# EAGLE design MicroMod-LoRa-1W-Function-Board (EAGLE 9.6.2)
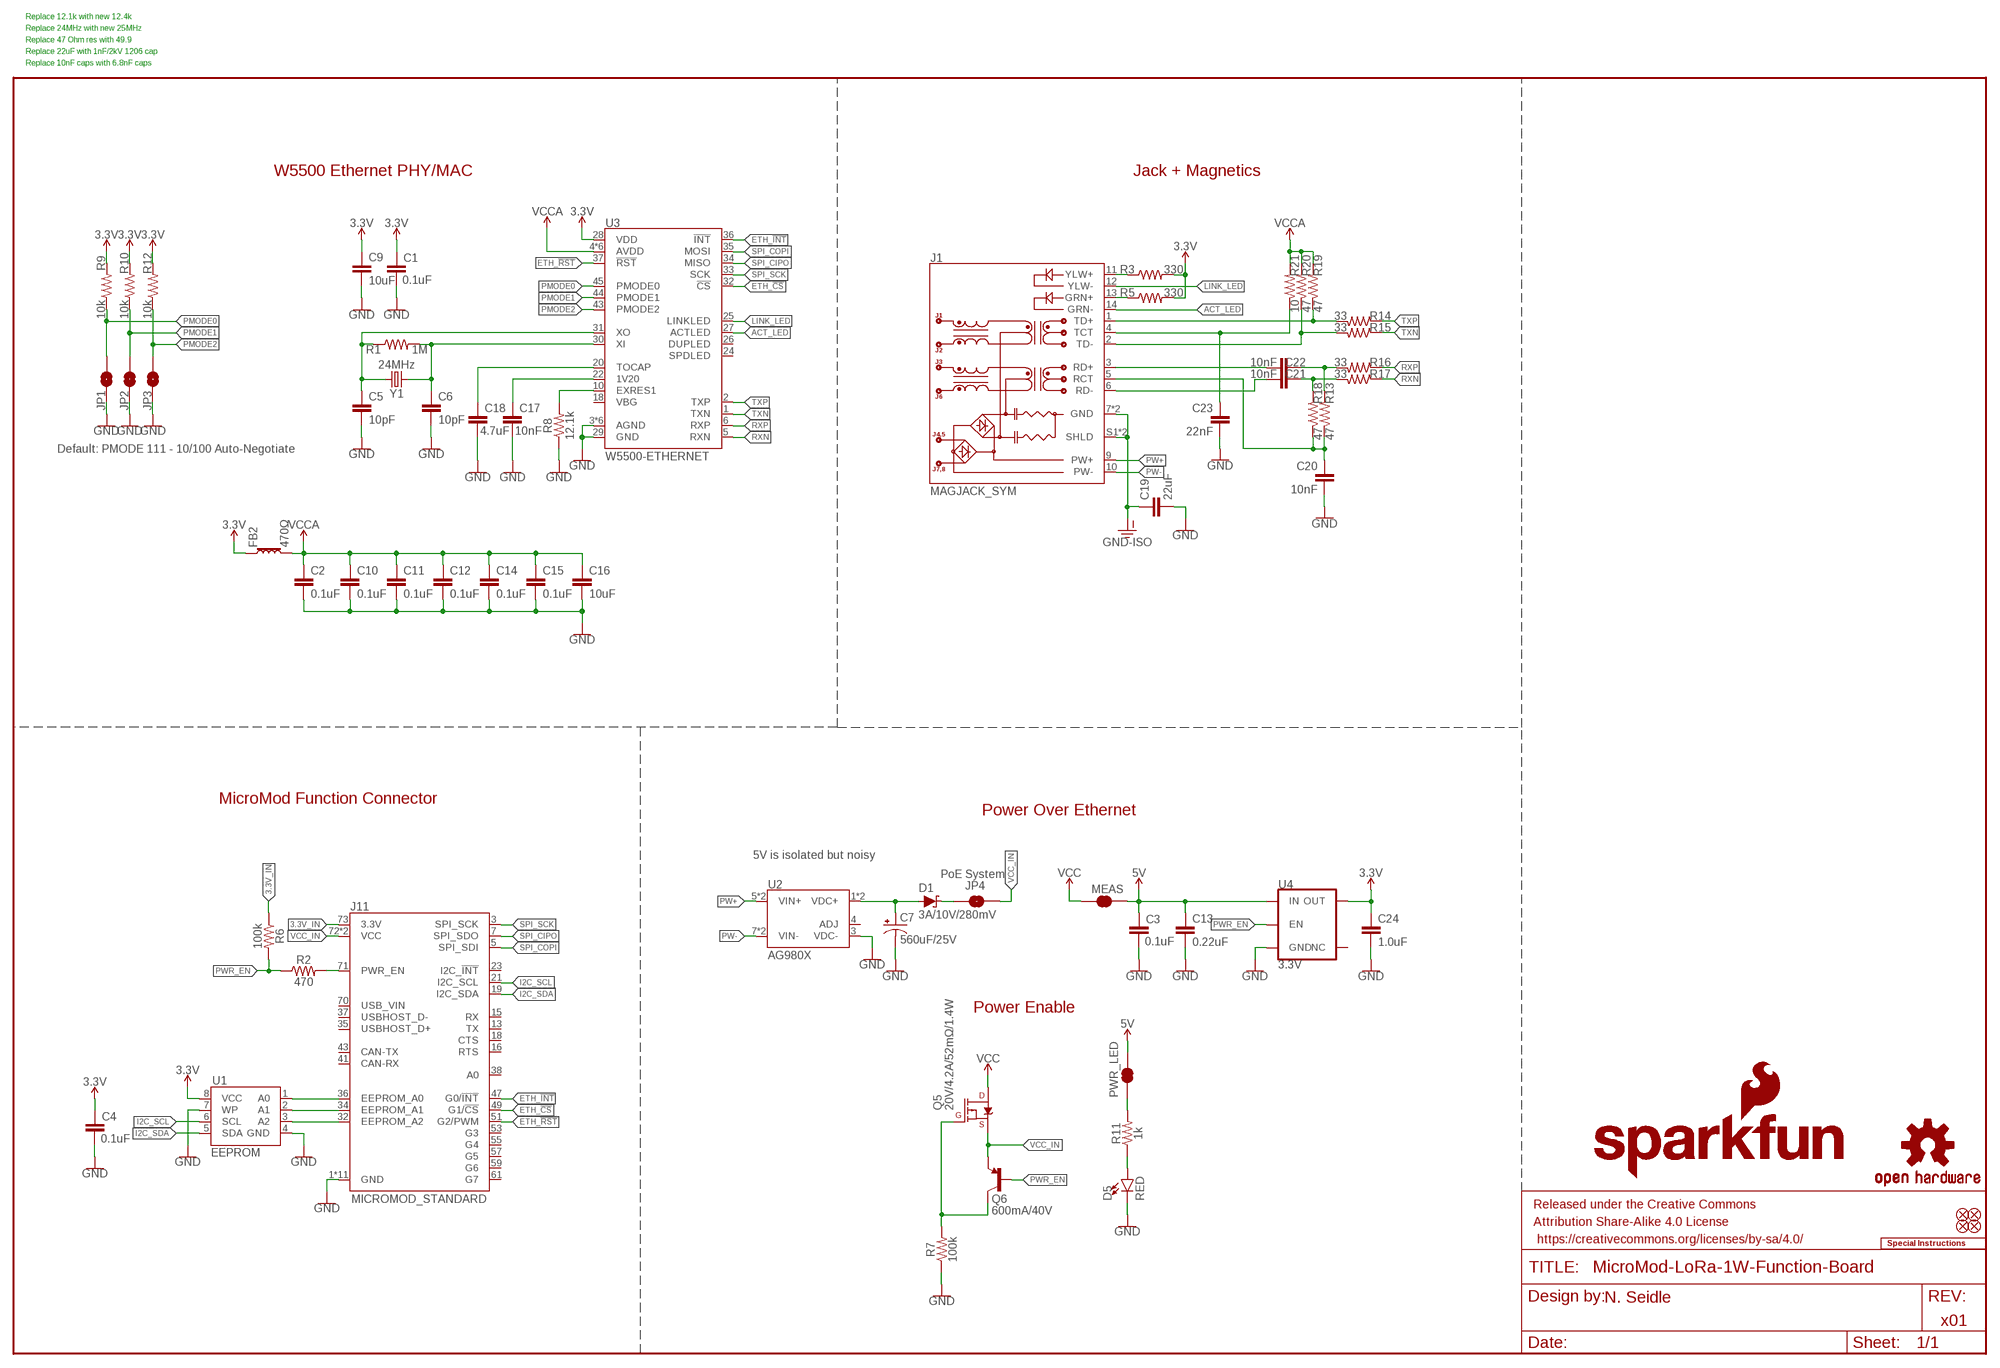
[diagram p0: schematic, sheet 1]

## Parts
C1  0.1uF  0.1UF-0603-25V-(+80/-20%)  [0603]
C2  0.1uF  0.1UF-0603-25V-5%  [0603]
C3  0.1uF  0.1UF-0603-25V-(+80/-20%)  [0603]
C4  0.1uF  0.1UF-0603-25V-(+80/-20%)  [0603]
C5  10pF  10PF-0603-50V-5%  [0603]
C6  10pF  10PF-0603-50V-5%  [0603]
C7  560uF/25V  560UF-PANASONIC_G-25V-20%  [PANASONIC_G]
C9  10uF  10UF-0603-6.3V-20%  [0603]
C10  0.1uF  0.1UF-0603-25V-5%  [0603]
C11  0.1uF  0.1UF-0603-25V-5%  [0603]
C12  0.1uF  0.1UF-0603-25V-5%  [0603]
C13  0.22uF  0.22UF-0603-25V-10%  [0603]
C14  0.1uF  0.1UF-0603-25V-5%  [0603]
C15  0.1uF  0.1UF-0603-25V-5%  [0603]
C16  10uF  10UF-0603-6.3V-20%  [0603]
C17  10nF  10NF-0603-50V-10%  [0603]
C18  4.7uF  4.7UF-0603-6.3V-(10%)  [0603]
C19  22uF  22UF-1206-50V-10%  [1206]
C20  10nF  10NF-0603-50V-10%  [0603]
C21  10nF  10NF-0603-50V-10%  [0603]
C22  10nF  10NF-0603-50V-10%  [0603]
C23  22nF  22NF/22,000PF-0603-50V-10%  [0603]
C24  1.0uF  1.0UF-0603-16V-10%-X7R  [0603]
D1  3A/10V/280mV  DIODE-SCHOTTKY-BAT60A  [SOD-323]
D5  RED  LED-RED0603  [LED-0603]
FB2  470Ω  FERRITE_BEAD-0603-470Ω-100MHZ-1A-200MILIΩ  [0603]
FD1  FIDUCIALUFIDUCIAL  [FIDUCIAL-MICRO]
FD2  FIDUCIALUFIDUCIAL  [FIDUCIAL-MICRO]
FD3  FIDUCIALUFIDUCIAL  [FIDUCIAL-MICRO]
FD4  FIDUCIALUFIDUCIAL  [FIDUCIAL-MICRO]
FRAME1  FRAME-LEDGER  [CREATIVE_COMMONS]
J1  MAGJACK_SYM  [MAGJACK-STR_LED]
J11  MICROMOD_STANDARD  [M.2-CARD-E-22_FUNCTION_STANDARD]
JP1  JUMPER-SMT_2_NO_SILK  [SMT-JUMPER_2_NO_SILK]
JP2  JUMPER-SMT_2_NO_SILK  [SMT-JUMPER_2_NO_SILK]
JP3  JUMPER-SMT_2_NO_SILK  [SMT-JUMPER_2_NO_SILK]
JP4  PoE System  JUMPER-SMT_2_NO_SILK  [SMT-JUMPER_2_NO_SILK]
LOGO1  SFE_LOGO_NAME_FLAME.1_INCH  [SFE_LOGO_NAME_FLAME_.1]
LOGO2  SPECIAL_INSTRUCTIONS-ORDERING  [ORDERING_INSTRUCTIONS]
LOGO3  OSHW-LOGOMINI  [OSHW-LOGO-MINI]
MEAS  JUMPER-COMBO_2_NC_TRACE  [COMBO-JUMPER_2_NC_TRACE]
PWR_LED  JUMPER-SMT_2_NC_TRACE_SILK  [SMT-JUMPER_2_NC_TRACE_SILK]
Q5  20V/4.2A/52mΩ/1.4W  MOSFET_PCH-DMG2305UX-7  [SOT23-3]
Q6  600mA/40V  TRANS_PNP-MMBT4403  [SOT23-3]
R1  1M  1MOHM-0603-1/4W-5%  [0603]
R2  470  470OHM-0603-1/10W-1%  [0603]
R3  330  330OHM-0603-1/10W-1%  [0603]
R5  330  330OHM-0603-1/10W-1%  [0603]
R6  100k  100KOHM-0603-1/10W-1%  [0603]
R7  100k  100KOHM-0603-1/10W-1%  [0603]
R8  12.1k  12.1KOHM-0603-1/10W-1%  [0603]
R9  10k  10KOHM-0603-1/10W-1%  [0603]
R10  10k  10KOHM-0603-1/10W-1%  [0603]
R11  1k  1KOHM-0603-1/10W-1%  [0603]
R12  10k  10KOHM-0603-1/10W-1%  [0603]
R13  47  47OHM-0603-1/10W-1%  [0603]
R14  33  33OHM-0603-1/10W-1%  [0603]
R15  33  33OHM-0603-1/10W-1%  [0603]
R16  33  33OHM-0603-1/10W-1%  [0603]
R17  33  33OHM-0603-1/10W-1%  [0603]
R18  47  47OHM-0603-1/10W-1%  [0603]
R19  47  47OHM-0603-1/10W-1%  [0603]
R20  47  47OHM-0603-1/10W-1%  [0603]
R21  10  10OHM-0603-1/10W-1%  [0603]
U1  EEPROM  EEPROM-I2C512K  [SO08]
U2  AG980X  [AG980X]
U3  W5500-ETHERNET  [LQFP-48]
U4  3.3V  V_REG_AP2112K-3.3V  [SOT23-5]
Y1  24MHz  CRYSTAL-24MHZ-SMD-2.0X1.6MM  [CRYSTAL-SMD-2.0X1.6MM]

## Nets
3.3V: C1.1 C4.1 C9.1 C24.1 FB2.1 R3.2 R5.2 R9.2 R10.2 R12.2 U1.8(VCC) U3.28(VDD) U4.5(OUT)
3.3V_IN: J11.73(3.3V) R6.1
5V: C3.1 C13.1 MEAS.2 MEAS.4 PWR_LED.2 U4.1(IN)
5V_RAW: C7.+ D1.A U2.1(VDC+) U2.2(VDC+)
A0: J11.36(EEPROM_A0) U1.1(A0)
A1: J11.34(EEPROM_A1) U1.2(A1)
A2: J11.32(EEPROM_A2) U1.3(A2)
ACT_LED: J1.14(GRN-) U3.27(ACTLED)
ETH_!CS!: J11.49(G1/!CS!) U3.32(!CS!)
ETH_!INT!: J11.47(G0/!INT!) U3.36(!INT!)
ETH_!RST!: J11.51(G2/PWM) U3.37(!RST!)
GND: C1.2 C2.2 C3.2 C4.2 C5.2 C6.2 C7.- C9.2 C10.2 C11.2 C12.2 C13.2 C14.2 C15.2 C16.2 C17.2 C18.2 C19.2 C20.2 C23.2 C24.2 D5.C J11.1(GND) J11.33(GND) J11.39(GND) J11.45(GND) J11.75(GND) J11.GND1(GND) J11.GND2(GND) J11.GND3(GND) J11.GND4(GND) J11.GND5(GND) J11.GND6(GND) JP1.1 JP2.1 JP3.1 R7.1 R8.1 U1.4(GND) U1.7(WP) U2.3(VDC-) U3.3(AGND) U3.9(AGND) U3.14(AGND) U3.16(AGND) U3.19(AGND) U3.29(GND) U3.48(AGND) U4.2(GND)
GND-ISO: C19.1 J1.7(GND) J1.8(GND) J1.S1(SHLD) J1.S2(SHLD)
I2C_SCL: J11.21(I2C_SCL) U1.6(SCL)
I2C_SDA: J11.19(I2C_SDA) U1.5(SDA)
LINK_LED: J1.12(YLW-) U3.25(LINKLED)
N$1: C5.1 R1.1 U3.31(XO) Y1.1
N$2: C6.1 R1.2 U3.30(XI) Y1.3
N$4: J11.71(PWR_EN) R2.2
N$5: D5.A R11.1
N$6: PWR_LED.1 R11.2
N$7: D1.C JP4.1
N$8: J1.13(GRN+) R5.1
N$10: J1.11(YLW+) R3.1
N$11: Q5.1(G) Q6.3(C) R7.2
N$13: R8.2 U3.10(EXRES1)
N$15: C17.1 U3.22(1V20)
N$16: C18.1 U3.20(TOCAP)
PMODE0: JP1.2 R9.1 U3.45(PMODE0)
PMODE1: JP2.2 R10.1 U3.44(PMODE1)
PMODE2: JP3.2 R12.1 U3.43(PMODE2)
PW+: J1.9(PW+) U2.5(VIN+) U2.6(VIN+)
PW-: J1.10(PW-) U2.7(VIN-) U2.8(VIN-)
PWR_EN: Q6.1(B) R2.1 R6.2 U4.3(EN)
RCT: C20.1 J1.5(RCT) R13.1 R18.1
RD+: C22.2 J1.3(RD+)
RD-: C21.2 J1.6(RD-)
RXN: R17.1 U3.5(RXN)
RXN1: C21.1 R17.2 R18.2
RXP: R16.1 U3.6(RXP)
RXP1: C22.1 R13.2 R16.2
SPI_CIPO: J11.7(SPI_SDO) U3.34(MISO)
SPI_COPI: J11.5(SPI_SDI) U3.35(MOSI)
SPI_SCK: J11.3(SPI_SCK) U3.33(SCK)
TCT: C23.1 J1.4(TCT) R21.1
TD+: J1.1(TD+) R14.2 R19.1
TD-: J1.2(TD-) R15.2 R20.1
TXN: R15.1 U3.1(TXN)
TXP: R14.1 U3.2(TXP)
VCC: MEAS.1 MEAS.3 Q5.3(D)
VCC_IN: J11.72(VCC) J11.74(VCC) JP4.2 Q5.2(S) Q6.2(E)
VCCA: C2.1 C10.1 C11.1 C12.1 C14.1 C15.1 C16.1 FB2.2 R19.2 R20.2 R21.2 U3.4(AVDD) U3.8(AVDD) U3.11(AVDD) U3.15(AVDD) U3.17(AVDD) U3.21(AVDD)
Unconnected: J11.13(TX) J11.15(RX) J11.16(RTS) J11.18(CTS) J11.23(I2C_!INT!) J11.35(USBHOST_D+) J11.37(USBHOST_D-) J11.38(A0) J11.41(CAN-RX) J11.43(CAN-TX) J11.53(G3) J11.55(G4) J11.57(G5) J11.59(G6) J11.61(G7) J11.70(USB_VIN) U2.4(ADJ) U3.18(VBG) U3.24(SPDLED) U3.26(DUPLED) U4.4(NC)

## Notes on the sheet
- Replace 12.1k with new 12.4k
- Replace 24MHz with new 25MHz
- Replace 47 Ohm res with 49.9
- Replace 22uF with 1nF/2kV 1206 cap
- Replace 10nF caps with 6.8nF caps
- W5500 Ethernet PHY/MAC | Jack + Magnetics
- Default: PMODE 111 - 10/100 Auto-Negotiate
- MicroMod Function Connector
- Power Over Ethernet
- 5V is isolated but noisy
- Power Enable
- N. Seidle
- x01

## Library data of the parts
C1 C3 C4 = SparkFun-Capacitors:0.1UF: 0.1µF ceramic capacitors A capacitor is a passive two-terminal electrical component used to store electrical energy temporarily in an electric field.; PROD_ID: CAP-00810
C2 C10-C12 C14 C15 = SparkFun-Capacitors:0.1UF: 0.1µF ceramic capacitors A capacitor is a passive two-terminal electrical component used to store electrical energy temporarily in an electric field.; PROD_ID: CAP-08604
C5 C6 = SparkFun-Capacitors:10PF: 10pF ceramic capacitors A capacitor is a passive two-terminal electrical component used to store electrical energy temporarily in an electric field.; PROD_ID: CAP-11812
C7 = SparkFun-Capacitors:560UF: 560µF polarized capacitors A capacitor is a passive two-terminal electrical component used to store electrical energy temporarily in an electric field.; PROD_ID: CAP-09983; VALUE: 560uF
C9 C16 = SparkFun-Capacitors:10UF: 10.0µF ceramic capacitors A capacitor is a passive two-terminal electrical component used to store electrical energy temporarily in an electric field.; PROD_ID: CAP-11015
C13 = SparkFun-Capacitors:0.22UF: 0.22µF ceramic capacitors A capacitor is a passive two-terminal electrical component used to store electrical energy temporarily in an electric field.; PROD_ID: CAP-07822
C17 C20-C22 = SparkFun-Capacitors:10NF: 0.01uF/10nF/10,000pF ceramic capacitors A capacitor is a passive two-terminal electrical component used to store electrical energy temporarily in an electric field. CAP-09321; PROD_ID: CAP-00867
C18 = SparkFun-Capacitors:4.7UF: 4.7µF ceramic capacitors A capacitor is a passive two-terminal electrical component used to store electrical energy temporarily in an electric field.; PROD_ID: CAP-08280
C19 = SparkFun-Capacitors:22UF: 22µF ceramic capacitors A capacitor is a passive two-terminal electrical component used to store electrical energy temporarily in an electric field.; PROD_ID: CAP-15263
C23 = SparkFun-Capacitors:22NF/22,000PF: 0.022uF/22nF/22,000pF ceramic capacitors A capacitor is a passive two-terminal electrical component used to store electrical energy temporarily in an electric field.; PROD_ID: CAP-07885
C24 = SparkFun-Capacitors:1.0UF: 1µF ceramic capacitors A capacitor is a passive two-terminal electrical component used to store electrical energy temporarily in an electric field.; PROD_ID: CAP-13930
D1 = SparkFun-DiscreteSemi:DIODE-SCHOTTKY: Schottky diode A Schottky diode is a semiconductor diode which has a low forward voltage drop and a very fast switching action.; PROD_ID: DIO-14072
D5 = SparkFun-LED:LED-RED: Red SMD LED Used in manufacturing of most products at SparkFun Packages: 0603 - SMD 0603 package [Product Link] <http://docs.avagotech.com/docs/AV02-0551EN> 0603 SMART - SMD 0603 SMART package ( more efficient and expensive)[Product Link] <http://www.osram-os.com/Graphics/XPic2/00077099_0.pdf> 1206 - SMD1206 package [Product Link] <https://www.sparkfun.com/datasheets/DevTools/LilyPad/Q150OVS4.pdff> SparkFun Products: Pro Mini 328 -5V <https://www.sparkfun.com/products/821> RedBoard <https://www.sparkfun.com/products/12757> IOIO-OTG <https://www.sparkfun.com/products/13613>; PROD_ID: DIO-00819
FB2 = SparkFun-Coils:FERRITE_BEAD: Ferrite Bead (blocks, cores, rings, chokes, etc.) Inductor with layers of ferrite used to suppress high frequencies. Often used to isolate high frequency noise. SparkFun Products: IOIO-OTG - V2.2 <https://www.sparkfun.com/products/13613> SparkFun SAMD21 Mini Breakout <https://www.sparkfun.com/products/13664> SparkFun 6 Degrees of Freedom Breakout - LSM6DS3 <https://www.sparkfun.com/products/13339> SparkFun SAMD21 Dev Breakout <https://www.sparkfun.com/products/13672>; PROD_ID: NDUC-12579
FD1-FD4 = SparkFun-Aesthetics:FIDUCIAL: Fiducial Alignment Points Point-of-reference for pick-and-place machines and other optical instruments.
FRAME1 = SparkFun-Aesthetics:FRAME-LEDGER: Schematic Frame - Ledger Standard 11x14 US Ledger frame
J1 = Ethernet:MAGJACK_SYM
J11 = SparkFun-MicroMod-Function:MICROMOD: MicroMod Connector Description: A card edge connector and mating PCB connector to allow various MicroMod Processor Boards to be coupled with various carrier boards of different capabilities. Based on the M.2 standard.
JP1-JP4 = SparkFun-Jumpers:JUMPER-SMT_2_NO: Normally open jumper This jumper has two pads in close proximity to each other. Apply solder to close the connection. Round pads are easier to solder for beginners, but are a lot larger. SparkFun Product that uses the round pads: SparkFun EL Sequencer <https://www.sparkfun.com/products/12781>
LOGO1 = SparkFun-Aesthetics:SFE_LOGO_NAME_FLAME: SparkFun Font Logo w/ Flame This is the SparkFun full logo. The logo on the schematic will always be the same size; the package variant is the height of the flame part of the logo. Default layer for the logo on the board is tSilk.
LOGO2 = SparkFun-Aesthetics:SPECIAL_INSTRUCTIONS: Special Ordering/Production Instructions Alert Symbol for special PCB ordering instructions or unique production process warnings. Ordering Instructions Production Instructions Types of information that should be added to box: Copper weight Soldermask color Silk color PCB thickness Number of layers PCB Standard: 1.6mm FR4 1 oz copper immersion silver plating red soldermask white silkscreen Types of information that should be added to box: Special wash requirements Depaneling instructions Humidification Glue curing Default text settings: 0.07 inch 9% ratio 50% line distance
LOGO3 = SparkFun-Aesthetics:OSHW-LOGO: Open-Source Hardware (OSHW) Logo This logo indicates the piece of hardware it is found on incorporates a OSHW license and/or adheres to the definition of open source hardware found here: http://freedomdefined.org/OSHW
MEAS = SparkFun-Jumpers:JUMPER-COMBO_2_NC_TRACE
PWR_LED = SparkFun-Jumpers:JUMPER-SMT_2_NC_TRACE: Normally closed trace jumper This jumper has a trace between two pads so it's normally closed (NC). Use a razor knife to open the connection. For best results follow the IPC guidelines for cutting traces: Cutout at least 0.063 mm (0.005 in). Remove all loose material to clean up the cut area. Seal the cut with an approved epoxy. Reapply solder to reclose the connection.
Q5 = SparkFun-DiscreteSemi:MOSFET_PCH: P-channel MOSFETs Voltage controlled devices that allow control of high current outputs. SparkFun Products: SparkFun ESP32 Thing <https://www.sparkfun.com/products/13907> SparkFun ESP8266 Thing <https://www.sparkfun.com/products/13231> SparkFun Pi Servo HAT V2 <https://www.sparkfun.com/products/15316> DMG2305UX-7 (20V/4.2A/SOT23-3); PROD_ID: TRANS-14388
Q6 = SparkFun-DiscreteSemi:TRANS_PNP: PNP transistor Current controlled devices typically used to amplify current or used as a switch. SparkFun Products: SparkFun Serial Enabled 16x2 LCD - Red on Black <https://www.sparkfun.com/products/9068> SparkFun Logomatic <https://www.sparkfun.com/products/12772>; PROD_ID: TRANS-09245
R1 = SparkFun-Resistors:1MOHM: 1MΩ resistor A resistor is a passive two-terminal electrical component that implements electrical resistance as a circuit element. Resistors act to reduce current flow, and, at the same time, act to lower voltage levels within circuits. - Wikipedia; PROD_ID: RES-07868
R2 = SparkFun-Resistors:470OHM: 470Ω resistor A resistor is a passive two-terminal electrical component that implements electrical resistance as a circuit element. Resistors act to reduce current flow, and, at the same time, act to lower voltage levels within circuits. - Wikipedia; PROD_ID: RES-07869
R3 R5 = SparkFun-Resistors:330OHM: 330Ω resistor A resistor is a passive two-terminal electrical component that implements electrical resistance as a circuit element. Resistors act to reduce current flow, and, at the same time, act to lower voltage levels within circuits. - Wikipedia; PROD_ID: RES-00818
R6 R7 = SparkFun-Resistors:100KOHM: 100kΩ resistor A resistor is a passive two-terminal electrical component that implements electrical resistance as a circuit element. Resistors act to reduce current flow, and, at the same time, act to lower voltage levels within circuits. - Wikipedia; PROD_ID: RES-07828
R8 = SparkFun-Resistors:12.1KOHM: 12.1kΩ resistor A resistor is a passive two-terminal electrical component that implements electrical resistance as a circuit element. Resistors act to reduce current flow, and, at the same time, act to lower voltage levels within circuits. - Wikipedia; PROD_ID: RES-09378
R9 R10 R12 = SparkFun-Resistors:10KOHM: 10kΩ resistor A resistor is a passive two-terminal electrical component that implements electrical resistance as a circuit element. Resistors act to reduce current flow, and, at the same time, act to lower voltage levels within circuits. - Wikipedia; PROD_ID: RES-00824
R11 = SparkFun-Resistors:1KOHM: 1kΩ resistor A resistor is a passive two-terminal electrical component that implements electrical resistance as a circuit element. Resistors act to reduce current flow, and, at the same time, act to lower voltage levels within circuits. - Wikipedia; PROD_ID: RES-07856
R13 R18-R20 = SparkFun-Resistors:47OHM: 47Ω resistor A resistor is a passive two-terminal electrical component that implements electrical resistance as a circuit element. Resistors act to reduce current flow, and, at the same time, act to lower voltage levels within circuits. - Wikipedia; PROD_ID: RES-14282
R14-R17 = SparkFun-Resistors:33OHM: 33Ω resistor A resistor is a passive two-terminal electrical component that implements electrical resistance as a circuit element. Resistors act to reduce current flow, and, at the same time, act to lower voltage levels within circuits. - Wikipedia; PROD_ID: RES-08270
R21 = SparkFun-Resistors:10OHM: 10Ω resistor A resistor is a passive two-terminal electrical component that implements electrical resistance as a circuit element. Resistors act to reduce current flow, and, at the same time, act to lower voltage levels within circuits. - Wikipedia; PROD_ID: RES-12581
U1 = SparkFun-IC-Memory:EEPROM-I2C: I2C EEPROMs, 24LC256 and others 24LC256 Series 256 kb I2C 2 Wire (32 k x 8 Bit) 2.5 V Serial EEPROM SMD - SOIC-8 Datasheet SparkFun Products SparkFun UDB5 - PIC UAV Development Board <https://www.sparkfun.com/products/11703> (GPS-11703); PROD_ID: IC-14645
U2 = Ethernet:AG980X
U3 = Ethernet:W5500-ETHERNET
U4 = SparkFun-IC-Power:V_REG_AP2112: AP2112 - 600mA CMOS LDO Regulator w/ Enable The AP2112 is CMOS process low dropout linear regulator with enable function, the regulator delivers a guaranteed 600mA (min.) continuous load current. Features Output Voltage Accuracy: ±1.5% Output Current: 600mA (Min.) Foldback Short Current Protection: 50mA Enable Function to Turn ON/OFF VOUT Low Dropout Voltage (3.3V): 250mV (Typ.) @IOUT=600mA Excellent Load Regulation: 0.2%/A (Typ.) Excellent Line Regulation: 0.02%/V (Typ.) Low Quiescent Current: 55μA (Typ.) Low Standby Current: 0.01μA (Typ.) Low Output Noise: 50μVRMS PSRR: 100Hz -65dB, 1kHz -65dB OTSD Protection Stable with 1.0μF Flexible Cap: Ceramic, Tantalum and Aluminum Electrolytic Operation Temperature Range: -40°C to 85°C ESD: MM 400V, HBM 4000V; PROD_ID: VREG-12457
Y1 = SparkFun-Clocks:CRYSTAL-24MHZ: 24MHz Crystal Datasheet <http://www.sparkfun.com/datasheets/Components/AT-SMD-5x3.pdf> Frequency: 24MHz Frequency Tolerance: ±20ppm Load Capacitance: 12pF SparkFun Products: USB Bit Whacker <https://www.sparkfun.com/products/762>; PROD_ID: XTAL-14845

## Net classes
0 default: width 0 mm, drill 0 mm
1 vcc: width 0 mm

## Board
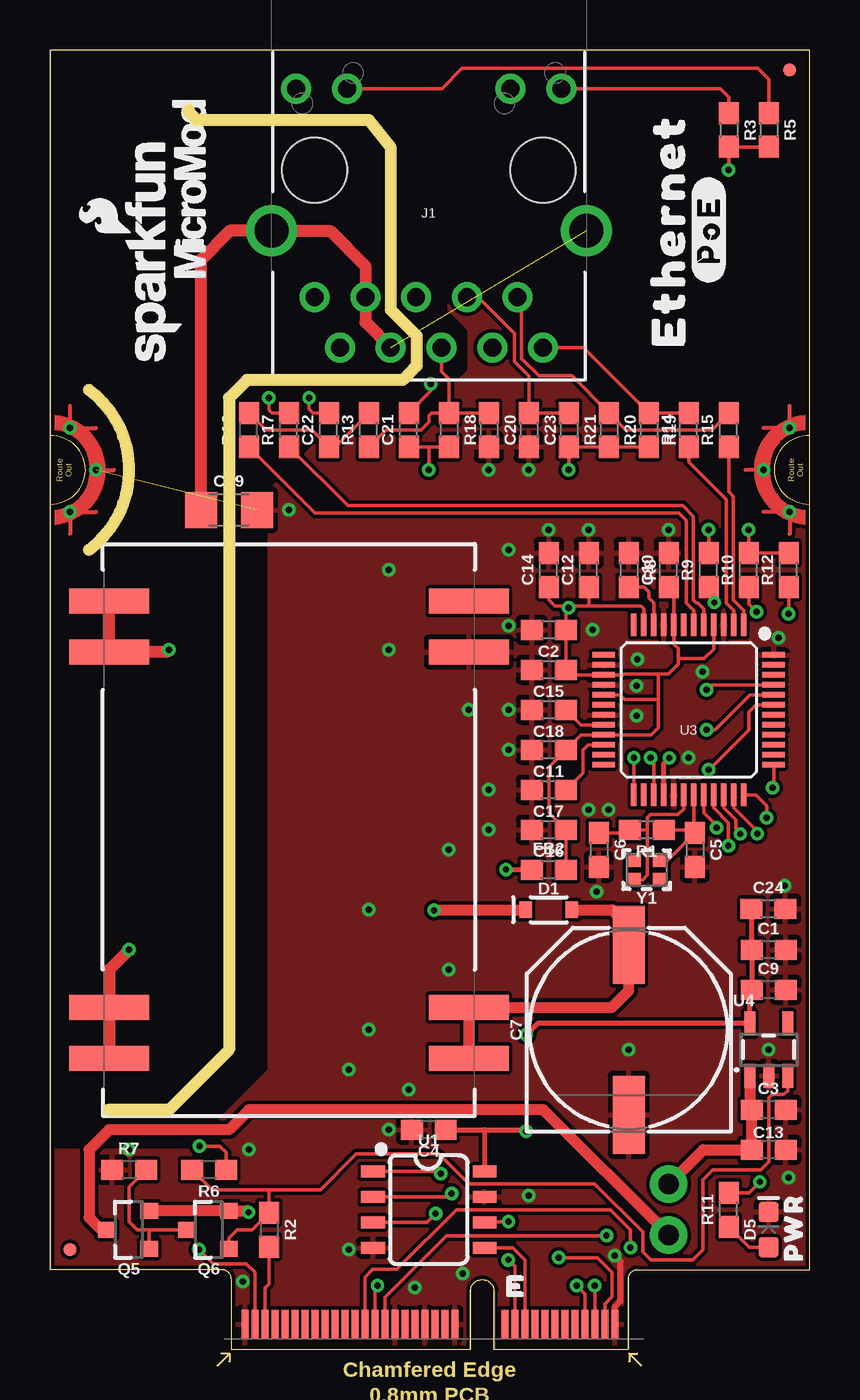
[diagram p1: board, top side]
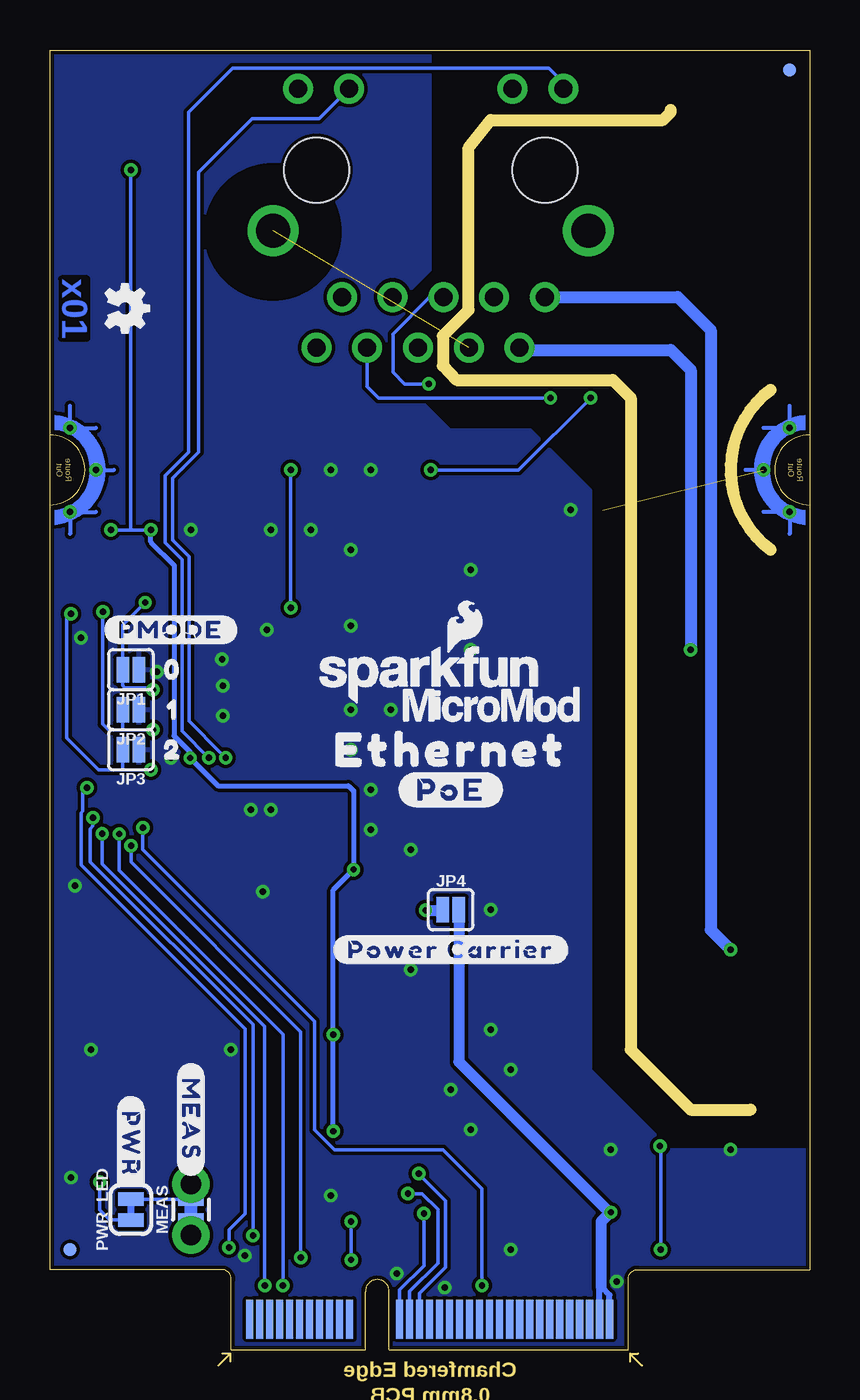
[diagram p2: board, bottom side, seen from below]

Size 38 x 65 mm. Coordinates in mm from the lower left corner, seen from the top.
Outline: 28.93,0 22.22,0 22.22,2.9 arc180 21.02,2.9 21.02,0 9.07,0 9.07,3.5 arc90 8.6,4 0,4 0,65 38,65 38,4 29.4,4 arc90 28.93,3.5 28.93,0
Copper layers (1*16): Top/Horz 0.035mm / dielectric 1.5mm / Bottom/Vert 0.035mm
Design rules "SparkFun-2-layer-TIGHT *": minimum track width 7mil, minimum drill 12mil, track to track 7mil, track to pad 7mil, pad to pad 7mil, via to via 7mil, smd to smd 7mil, copper to edge 7mil, drill to drill 7mil, minimum pad ring 7mil, minimum via ring 7mil, stop-mask expansion 4mil, vias tented up to drill 25mil, thermal gap 10mil
tRestrict: area 23.7,52.8 to 30,59
bRestrict: area 23.7,52.8 to 30,59
Milling: 14 lines

### Footprints (pad centres in the part's own frame; a part is rotated, then mirrored left to right if it is on the bottom)
0603 = smd 1.1 x 1: 1 -0.85,0; 2 0.85,0
PANASONIC_G = smd 3.9 x 1.6: + 4.25,0; - -4.25,0
1206 = smd 1.6 x 1.8: 1 -1.4,0; 2 1.4,0
SOD-323 = smd 0.63 x 0.83: A 1.15,0; C -1.15,0
LED-0603 = smd 1 x 1: A -0.877,0; C 0.877,0
FIDUCIAL-MICRO = smd 0.635 x 0.635: 1 0,0
MAGJACK-STR_LED = drill 0.9 pad 1.5: 1 -5.715,8.89; 2 -4.445,6.35; 3 -3.175,8.89; 4 -1.905,6.35; 5 -0.635,8.89; 6 0.635,6.35; 7 1.905,8.89; 8 3.175,6.35; 9 4.445,8.89; 10 5.715,6.35; 11 -6.63,-4.06; 12 -4.09,-4.06; 13 4.09,-4.06; 14 6.63,-4.06 | drill 1.7 pad 2.4: S1 -7.875,3.05; S2 7.875,3.05 | hole 3.25: -5.715,0; 5.715,0
M.2-CARD-E-22_FUNCTION_STANDARD = smd 0.35 x 1.45: 1 9.25,1.275; 3 8.75,1.275; 5 8.25,1.275; 7 7.75,1.275; 9 7.25,1.275; 11 6.75,1.275; 13 6.25,1.275; 15 5.75,1.275; 17 5.25,1.275; 19 4.75,1.275; 21 4.25,1.275; 23 3.75,1.275; 33 1.25,1.275; 35 0.75,1.275; 37 0.25,1.275; 39 -0.25,1.275; 41 -0.75,1.275; 43 -1.25,1.275; 45 -1.75,1.275; 47 -2.25,1.275; 49 -2.75,1.275; 51 -3.25,1.275; 53 -3.75,1.275; 55 -4.25,1.275; 57 -4.75,1.275; 59 -5.25,1.275; 61 -5.75,1.275; 63 -6.25,1.275; 65 -6.75,1.275; 67 -7.25,1.275; 69 -7.75,1.275; 71 -8.25,1.275; 73 -8.75,1.275; 75 -9.25,1.275 | smd 0.35 x 1.95 bottom: 2 9,1.525; 4 8.5,1.525; 6 8,1.525; 8 7.5,1.525; 10 7,1.525; 12 6.5,1.525; 14 6,1.525; 16 5.5,1.525; 18 5,1.525; 20 4.5,1.525; 22 4,1.525; 32 1.5,1.525; 34 1,1.525; 36 0.5,1.525; 38 0,1.525; 40 -0.5,1.525; 42 -1,1.525; 44 -1.5,1.525; 46 -2,1.525; 48 -2.5,1.525; 50 -3,1.525; 52 -3.5,1.525; 54 -4,1.525; 56 -4.5,1.525; 58 -5,1.525; 60 -5.5,1.525; 62 -6,1.525; 64 -6.5,1.525; 66 -7,1.525; 68 -7.5,1.525; 70 -8,1.525; 72 -8.5,1.525; 74 -9,1.525 | drill 0.305 pad 0.61: GND1 -18,41.9; GND2 -16.7,44; GND3 -18,46.1; GND4 18,41.9; GND5 16.7,44; GND6 18,46.1
SMT-JUMPER_2_NO_SILK = smd 0.635 x 1.27: 1 -0.406,0; 2 0.406,0
COMBO-JUMPER_2_NC_TRACE = smd 0.635 x 1.27: 1 -0.508,0; 2 0.508,0 | drill 1.016 pad 1.88: 3 -1.27,0; 4 1.27,0
SMT-JUMPER_2_NC_TRACE_SILK = smd 0.66 x 1.27: 1 -0.521,0; 2 0.521,0
SOT23-3 = smd 0.8 x 0.9: 1 -0.95,-1; 2 0.95,-1; 3 0,1.1
SO08 = smd 0.6 x 1.2: 1 -1.905,-2.8; 2 -0.635,-2.8; 3 0.635,-2.8; 4 1.905,-2.8; 5 1.905,2.8; 6 0.635,2.8; 7 -0.635,2.8; 8 -1.905,2.8
AG980X = smd 1.25 x 4: 1 -11.43,-9; 2 -8.89,-9; 3 8.89,-9; 4 11.43,-9; 5 11.43,9; 6 8.89,9; 7 -8.89,9; 8 -11.43,9
LQFP-48 = smd 0.254 x 1.143: 1 -2.75,-4.25; 2 -2.25,-4.25; 3 -1.75,-4.25; 4 -1.25,-4.25; 5 -0.75,-4.25; 6 -0.25,-4.25; 7 0.25,-4.25; 8 0.75,-4.25; 9 1.25,-4.25; 10 1.75,-4.25; 11 2.25,-4.25; 12 2.75,-4.25; 25 2.75,4.25; 26 2.25,4.25; 27 1.75,4.25; 28 1.25,4.25; 29 0.75,4.25; 30 0.25,4.25; 31 -0.25,4.25; 32 -0.75,4.25; 33 -1.25,4.25; 34 -1.75,4.25; 35 -2.25,4.25; 36 -2.75,4.25 | smd 1.143 x 0.254: 13 4.25,-2.75; 14 4.25,-2.25; 15 4.25,-1.75; 16 4.25,-1.25; 17 4.25,-0.75; 18 4.25,-0.25; 19 4.25,0.25; 20 4.25,0.75; 21 4.25,1.25; 22 4.25,1.75; 23 4.25,2.25; 24 4.25,2.75; 37 -4.25,2.75; 38 -4.25,2.25; 39 -4.25,1.75; 40 -4.25,1.25; 41 -4.25,0.75; 42 -4.25,0.25; 43 -4.25,-0.25; 44 -4.25,-0.75; 45 -4.25,-1.25; 46 -4.25,-1.75; 47 -4.25,-2.25; 48 -4.25,-2.75
SOT23-5 = smd 0.55 x 1.2: 1 -0.95,-1.3; 2 0,-1.3; 3 0.95,-1.3; 4 0.95,1.3; 5 -0.95,1.3
CRYSTAL-SMD-2.0X1.6MM = smd 0.75 x 0.7: 1 -0.675,-0.5; 2 0.675,-0.5; 3 0.675,0.5; 4 -0.675,0.5

### Placement (x,y rotation side)
C1  35.95,20 0 top
C2  24.95,36 180 top
C3  35.95,12 0 top
C4  18.95,11 180 top
C5  32.25,25 270 top
C6  27.45,25 270 top
C7  28.95,16 90 top
C9  35.95,18 0 top
C10  30.95,39 90 top
C11  24.95,30 180 top
C12  26.95,39 90 top
C13  35.95,10 0 top
C14  24.95,39 90 top
C15  24.95,34 180 top
C16  24.95,26 180 top
C17  24.95,28 180 top
C18  24.95,32 180 top
C19  8.95,42 0 top
C20  21.95,46 270 top
C21  17.95,46 90 top
C22  13.95,46 90 top
C23  23.95,46 270 top
C24  35.94,22.05 0 top
D1  24.95,22 0 top
D5  35.95,6 90 top
FB2  24.95,24 0 top
FD1  1,5 90 top
FD2  37,64 90 top
FD3  37,5 270 bottom
FD4  1,64 270 bottom
FRAME1  35.51,-8.89 0 top  (outside the outline)
J1  18.95,59 180 top
J11  19,0 0 top
JP1  33.95,34 180 bottom
JP2  33.95,32 180 bottom
JP3  33.95,30 180 bottom
JP4  17.95,22 0 bottom
LOGO1  5.14,54.97 90 top
LOGO2  45.67,60.96 0 top  (outside the outline)
LOGO3  34.24,52.07 270 bottom
LOGO4  SFE_LOGO_NAME_FLAME.1_INCH  [SFE_LOGO_NAME_FLAME_.1]  18.97,33.76 0 bottom
MEAS  30.95,7 90 bottom
PWR_LED  33.95,7 90 bottom
Q5  3.95,6 90 top
Q6  7.95,6 90 top
R1  29.85,26 180 top
R2  10.95,6 270 top
R3  33.95,61 270 top
R5  35.95,61 270 top
R6  7.95,9 180 top
R7  3.95,9 0 top
R8  28.95,39 270 top
R9  32.95,39 90 top
R10  34.95,39 90 top
R11  33.95,7 90 top
R12  36.95,39 90 top
R13  15.95,46 90 top
R14  31.95,46 90 top
R15  33.95,46 90 top
R16  9.95,46 90 top
R17  11.95,46 90 top
R18  19.95,46 270 top
R19  29.95,46 270 top
R20  27.95,46 270 top
R21  25.95,46 270 top
U1  18.95,7 270 top
U2  11.95,26 90 top
U3  31.95,32 180 top
U4  35.95,15 0 top
U$1  [ETHERNET0]  17.95,30 0 bottom
U$2  [#POE#0]  17.95,28 0 bottom
U$3  [#POWER_CARRIER#0]  17.95,20 0 bottom
U$7  [PWR0]  37.2,6.1 90 top
U$9  [#PWR#0]  33.95,10.3 270 bottom
U$13  [#PMODE#0]  31.95,36 0 bottom
U$14  [01]  31.85,34 0 bottom
U$15  [12]  31.85,32 0 bottom
U$16  [23]  31.85,30 0 bottom
U$17  [ETHERNET0]  30.95,56 90 top
U$18  [#POE#0]  32.95,56 90 top
U$28  [#MEAS#3]  30.95,14.3 270 bottom
U$37  [MICROMOD_LOGO_.35]  15.97,32.22 0 bottom
U$63  [MICROMOD_LOGO_.35]  7,58 90 top
Y1  29.85,24 180 top

### Tracks (layer width: path | path; a pad name or v marks a point on that pad's centre or on a via)
3.3V  (via drill 0.3)
  Top/Horz 0.178: R5.2 R3.2 v33.95,59 | v34.95,41 R10.2 R12.2 | R9.2 v32.95,41
  Top/Horz 0.254: U3.28 30.7,29.3 v30.99,29.59 | C24.1 C1.1 C9.1 35,17.9 U4.5 24.38,16.3 v23.83,15.75 | FB2.1 v22.81,24 | C4.1 21.75,11 | 21.75,11 23.75,11 v23.83,10.92 | U1.8 21.75,11
  Bottom/Vert 0.178: v32.95,41 33.95,41 | 33.95,41 v34.95,41 | v33.95,59 33.95,41
  Bottom/Vert 0.254: v32.95,41 32.95,40.4 31.79,39.24 31.79,30.69 30.99,29.89 v30.99,29.59 29.59,28.19 23.06,28.19 22.81,27.94 v22.81,24 23.83,22.99 v23.83,15.75 v23.83,10.92
3.3V_IN  (via drill 0.3)
  Top/Horz 0.178: v7.45,5 8.15,4.29 9.81,4.29 10.25,3.86 J11.73 | R6.1 8.8,9.87 8.5,10.17 v7.48,10.17
  Bottom/Vert 0.178: v7.45,5 7.45,10.14 v7.48,10.17
5V
  Top/Horz 0.559: MEAS.4 32.68,10 C13.1 C3.1 35,12.1 U4.1
  Bottom/Vert 0.178: PWR_LED.2 30.96,7.52 MEAS.2 MEAS.4
5V_RAW
  Top/Horz 0.559: U2.1 U2.2 28.11,17.11 28.95,17.95 C7.+ 29.03,20.33 29.03,21.08 28.11,22 D1.A
A0  (via drill 0.3)
  Top/Horz 0.178: U1.1 19.45,8.9 v19.55,8.8
  Bottom/Vert 0.178: J11.36 19.5,2.83 18.2,4.12 18.2,7.45 v19.55,8.8
A1  (via drill 0.3)
  Top/Horz 0.178: U1.2 19.93,7.63 v20.1,7.8
  Bottom/Vert 0.178: J11.34 20,2.92 18.6,4.33 18.6,7 19.4,7.8 v20.1,7.8
A2  (via drill 0.3)
  Top/Horz 0.178: U1.3 18.86,6.37 v19.3,6.8
  Bottom/Vert 0.178: J11.32 20.5,3 19.3,4.2 | 19.3,4.2 v19.3,6.8 | 19.3,4.2
ACT_LED  (via drill 0.3)
  Top/Horz 0.178: U3.27 30.2,29.6 v30.05,29.6
  Bottom/Vert 0.178: J1.14 12.32,63.36 13.04,64.08 28.87,64.08 31.05,61.9 31.05,44.9 32.25,43.7 32.25,40.35 31.4,39.5 31.4,30.95 v30.05,29.6
ETH_!CS!  (via drill 0.3)
  Top/Horz 0.178: J11.49 16.25,3.06 v16.39,3.2 | U3.32 32.7,26.83 33.35,26.18 v33.35,26.1
  Bottom/Vert 0.178: v16.39,3.2 16.39,8.04 18.35,10 23.75,10 24.75,11 24.75,16.4 33.35,25 v33.35,26.1
ETH_!INT!  (via drill 0.3)
  Top/Horz 0.178: J11.47 16.75,2.62 19.83,5.7 v27.85,5.7 | U3.36 35.3,27.75 35.85,27.2 v35.85,26.6
  Bottom/Vert 0.178: v27.85,5.7 27.85,16.25 35.98,24.38 35.98,26.05 35.85,26.18 v35.85,26.6
ETH_!RST!  (via drill 0.3)
  Top/Horz 0.178: J11.51 15.75,3.61 16.15,4 17.34,4 20.34,7 28.05,7 29.05,6 v29.05,5.1 | U3.37 36.2,28.15 v36.15,28.1
  Bottom/Vert 0.178: v36.15,28.1 36.35,27.9 36.35,26.94 36.45,26.85 36.45,24.25 28.25,16.05 28.25,6.8 29.05,6 v29.05,5.1
GND  (via drill 0.3)  (1 unrouted)
  Top/Horz 0.305: J11.1 28.25,2.14 28.54,2.43 28.54,4.41 v28.25,4.7
  Bottom/Vert 0.178: J11.GND4 35.7,43.2 J11.GND5 | J11.GND3 2.3,44.8 J11.GND2 2.3,43.2 J11.GND1
  other vias: 3.95,10 18.25,3.1 20.65,3.8 36.95,8.6 35.95,15 36.75,23.2 27.35,22.9 31.95,29.6 29.35,31.7 29.35,33.2 29.4,34.53 27.15,36 36.45,35.6 32.65,33.9 30.95,41 26.95,41 24.95,41 22.95,36.2 22.95,32 22.95,30 21.95,28 21.95,26 11.95,42 21.95,44 16.95,11 23.95,7.7 14.95,5 9.65,3.4 9.95,10 14.95,14 15.95,16 15.95,22 17.95,13 19.95,19 19.95,25 16.95,35 20.95,32 16.95,39 22.95,40 23.95,44 26.95,27 27.95,27 28.95,15
  pour Top/Horz (isolate 0.152): -0.05,0 -0.05,10 6.95,10 10.95,14 10.95,43 13.95,46 17.95,46 20.95,49 20.95,51 19.95,52 19.95,53 18.95,54 18.95,65 37.95,65 37.95,0
  pour Bottom/Vert (isolate 0.152): -0.05,0 -0.05,10 6.95,10 10.95,14 10.95,43 13.95,46 17.95,46 20.95,49 20.95,51 19.95,52 19.95,53 18.95,54 18.95,65 37.95,65 37.95,0
GND-ISO  (1 unrouted)
  Top/Horz 0.6: C19.1 7.55,54.52 8.97,55.95 J1.S2 14,55.95 15.77,54.17 J1.8 15.77,51.38 J1.7
I2C_SCL  (via drill 0.3)
  Top/Horz 0.178: J11.21 23.25,4.16 v22.93,4.48 | U1.6 21.79,6.4 v22.94,6.4
  Bottom/Vert 0.178: v22.93,4.48 22.93,6.39 v22.94,6.4
I2C_SDA
  Top/Horz 0.178: J11.19 23.75,4.5 23.15,5.1 U1.5
LINK_LED  (via drill 0.3)
  Top/Horz 0.178: U3.25 29.2,29.59 v29.21,29.6
  Bottom/Vert 0.178: J1.12 24.54,61.56 27.89,61.56 30.56,58.89 30.56,44.89 31.87,43.58 31.87,40.48 31.04,39.65 31.04,39.5 31.04,31.44 29.45,29.85 29.45,29.84 v29.21,29.6
N$1
  Top/Horz 0.178: U3.31 32.2,26 | 32.2,26 32.2,25.9 C5.1 30.9,24.5 Y1.1 | R1.1 32.2,26
N$2
  Top/Horz 0.178: U3.30 31.7,27.05 31.42,26.77 30.04,26.77 29.88,26.61 29.88,26 | C6.1 28.85,25.85 R1.2 29.88,26 | 29.88,26 29.88,23.73 29.65,23.5 Y1.3
N$4
  Top/Horz 0.178: J11.71 10.75,3.1 10.95,3.3 R2.2
N$5
  Top/Horz 0.178: D5.A 34.98,5.12 R11.1
N$6  (via drill 0.3)
  Top/Horz 0.178: R11.2 34.98,7.85 v35.51,8.38
  Bottom/Vert 0.178: v35.51,8.38 35.51,6.99 35,6.48 PWR_LED.1
N$7  (via drill 0.3)
  Top/Horz 0.559: D1.C 23.77,21.97 v19.21,21.97
  Bottom/Vert 0.559: v19.21,21.97 18.38,21.97 JP4.1
N$8
  Top/Horz 0.178: J1.13 19.6,63.06 20.62,64.08 35.42,64.08 35.95,63.55 R5.1
N$10
  Top/Horz 0.178: J1.11 33.54,63.06 33.95,62.65 R3.1
N$11
  Top/Horz 0.178: Q6.3 4.95,6 | 4.95,6 4.35,6 3.95,6.4 3.95,8.15 R7.2 | Q5.1 4.95,6
N$13
  Top/Horz 0.178: U3.10 30.2,37.35 29.95,37.6 29.95,37.9 29.7,38.15 R8.2
N$15
  Top/Horz 0.178: U3.22 26.9,30.25 26.65,30 26.65,28.85 C17.1
N$16
  Top/Horz 0.178: U3.20 26.55,31.25 C18.1
PMODE0  (via drill 0.3)
  Top/Horz 0.178: U3.45 33.1,33.25 v32.85,33 | R9.1 33.23,37.87 v33.23,37.36
  Bottom/Vert 0.178: v32.85,33 32.95,33.1 34.25,33.1 34.36,33.2 JP1.2 34.36,36.24 v33.23,37.36
PMODE1  (via drill 0.3)
  Top/Horz 0.178: R10.1 34.95,37.3 v35.35,36.9 | U3.44 35,32.75 33.25,31 v32.85,31
  Bottom/Vert 0.178: v32.85,31 34.35,31 | 34.35,31 35.05,31 35.35,31.3 v35.35,36.9 | JP2.2 34.36,31.01 34.35,31
PMODE2  (via drill 0.3)
  Top/Horz 0.178: R12.1 v36.95,36.8 | U3.43 35.3,32.25 34.95,31.9 34.95,31 v32.95,29
  Bottom/Vert 0.178: v36.95,36.8 37.15,36.6 37.15,30.6 35.55,29 34.35,29 | v32.95,29 34.35,29 | JP3.2 34.36,29.01 34.35,29
PW+  (via drill 0.3)
  Top/Horz 0.6: U2.5 U2.6 5.84,34.89 v5.95,35
  Bottom/Vert 0.6: J1.9 14.39,50 6.95,50 5.95,49 v5.95,35
PW-  (via drill 0.3)
  Top/Horz 0.6: v3.95,20 2.95,19 U2.7 U2.8
  Bottom/Vert 0.6: J1.10 6.6,52.65 4.95,51 4.95,21 v3.95,20
PWR_EN
  Top/Horz 0.178: Q6.1 8.95,5.6 9.35,6 10.1,6 R2.1 10.95,8 | R6.2 8.1,8 10.95,8 | 10.95,8 13.54,8 15.32,9.78 19.47,9.78 20.95,8.3 27.25,8.3 29.65,5.9 29.65,4.9 30.05,4.5 32.15,4.5 32.65,5 32.65,8.5 33.15,9 35.55,9 35.95,9.4 35.95,12.58 36.14,12.77 36.72,12.77 36.9,12.95 U4.3
RCT
  Top/Horz 0.178: R13.1 16.8,46 18.55,46 18.95,46.4 18.95,46.7 19.1,46.85 R18.1 | C20.1 R18.1 | R18.1 19.95,48.55 19.59,48.91 J1.5
RD+  (via drill 0.3)
  Top/Horz 0.178: C22.2 13.15,46.85 12.96,47.04 v12.96,47.6
  Bottom/Vert 0.178: J1.3 22.12,48.17 21.55,47.6 v12.96,47.6
RD-  (via drill 0.3)
  Top/Horz 0.178: C21.2 19.05,47.95 v19.05,48.3
  Bottom/Vert 0.178: v19.05,48.3 20.25,48.3 20.85,48.9 20.85,50.8 19,52.65 J1.6
RXN
  Top/Horz 0.178: U3.5 32.7,37.05 32.42,37.33 32.34,37.33 32.18,37.49 32.18,41.67 31.65,42.2 14.9,42.2 R17.1
RXN1  (via drill 0.3)
  Top/Horz 0.178: C21.1 18.95,45.15 | 18.95,45.15 R18.2 | R17.2 11.1,46.85 10.95,47 v10.95,47.6 | v18.95,44 18.95,45.15
  Bottom/Vert 0.178: v10.95,47.6 14.55,44 v18.95,44
RXP
  Top/Horz 0.178: U3.6 32.2,36.97 31.83,37.34 31.83,41.47 31.45,41.84 13.26,41.84 R16.1
RXP1
  Top/Horz 0.178: R13.2 14.25,45.15 C22.1 13.1,46 10.8,46 R16.2
SPI_CIPO  (via drill 0.3)
  Top/Horz 0.178: J11.7 26.75,2.8 v26.35,3.2 | U3.34 33.7,27.1 34.3,26.5 34.3,26.03 v34.54,25.79
  Bottom/Vert 0.178: v26.35,3.2 26.35,15.76 34.54,23.95 v34.54,25.79
SPI_COPI  (via drill 0.3)
  Top/Horz 0.178: J11.5 v27.25,3.2 | U3.35 34.2,27.1 35.38,25.92 v35.38,25.8
  Bottom/Vert 0.178: v27.25,3.2 27.25,16.16 35.38,24.29 v35.38,25.8
SPI_SCK  (via drill 0.3)
  Top/Horz 0.178: J11.3 27.75,2.26 28.12,2.63 28.12,3.87 27.39,4.6 v25.45,4.6 | U3.33 33.2,27.09 33.95,26.35 v33.95,25.2
  Bottom/Vert 0.178: v33.95,25.2 33.95,24.4 25.45,15.9 v25.45,4.6
TCT
  Top/Horz 0.178: R21.1 C23.1 23.95,48.7 23.24,49.41 23.24,50.81 21.4,52.65 J1.4
TD+
  Top/Horz 0.178: J1.1 26.69,50.11 R19.1 R14.2
TD-
  Top/Horz 0.178: R15.2 33.1,46 28.8,46 R20.1 26.1,48.7 24.45,48.7 23.59,49.55 23.59,52.45 J1.2
TXN
  Top/Horz 0.178: U3.1 34.7,36.97 34.18,37.49 34.18,42.67 33.95,42.9 R15.1
TXP
  Top/Horz 0.178: U3.2 34.2,36.97 33.83,37.34 33.83,42.52 31.95,44.4 R14.1
VCC
  Top/Horz 0.559: MEAS.3 24.68,12 9.95,12 8.95,11 2.95,11 1.95,10 1.95,6.6 2.55,6 Q5.3
  Bottom/Vert 0.178: MEAS.3 MEAS.1
VCC_IN  (via drill 0.3)
  Top/Horz 0.559: v9.94,6.86 9.85,6.95 Q6.2 Q5.2
  Bottom/Vert 0.305: J11.74 10,2.73 10.4,3.12 10.44,3.12 10.5,3.06 J11.72
  Bottom/Vert 0.559: JP4.2 17.54,14.39 10.01,6.86 v9.94,6.86 9.97,6.86 10.44,6.39 10.44,3.12
VCCA  (via drill 0.3)
  Top/Horz 0.178: C10.1 31.2,37.9 U3.8 31.2,35.3 31.45,35.05 31.45,34.54 | U3.11 29.7,37.05 29.55,37.2 26.95,37.2 | U3.4 33.2,35.05 32.71,34.55 31.46,34.55 31.45,34.54 | R19.2 R20.2 R21.2 v25.95,44 | FB2.2 C16.1 24.95,26.85 24.95,29.15 C11.1 26.55,30.75 U3.21 30.06,30.75 30.43,31.11 30.43,32.51 | U3.17 28.52,32.75 28.76,32.51 30.43,32.51 | 31.45,34.54 31.45,34.29 30.94,33.78 30.43,33.78 | 30.43,33.78 30.43,32.51 | 29.81,33.78 29.8,33.8 28.7,33.8 28.66,33.75 U3.15 26.05,33.75 C15.1 C2.1 25.8,36.95 v25.95,37.1 25.95,37.2 | 29.72,33.78 29.81,33.78 | 29.81,33.78 30.43,33.78 | C14.1 24.95,37.5 25.25,37.2 25.95,37.2 | 26.95,37.2 25.95,37.2 | C12.1 26.95,37.2
  Bottom/Vert 0.178: v25.95,37.1 25.95,41 25.95,41.4 v25.95,44

### Text on the board
Bottom/Vert: x01
tDocu: Board Thickness is 0.8mm | 2-Layer | Beveled Edge | ENIG Finish | N. Seidle